# Altium schematic sheet Main.SchDoc
size A3; PageSetup: Record=PageOptions|CenterHorizontal=True|CenterVertical=True|PrintScale=0.73|XCorrection=1.00|YCorrection=1.00|PrintKind=1|BorderSize=5000000|LeftOffset=0|BottomOffset=0|Orientation=2|PaperLength=1000|PaperWidth=1000|Scale=100|PaperSource=7|PrintQuality=-3|MediaType=1|DitherType=10|PrintScaleMode=1|PaperKind=A4|PaperIndex=9
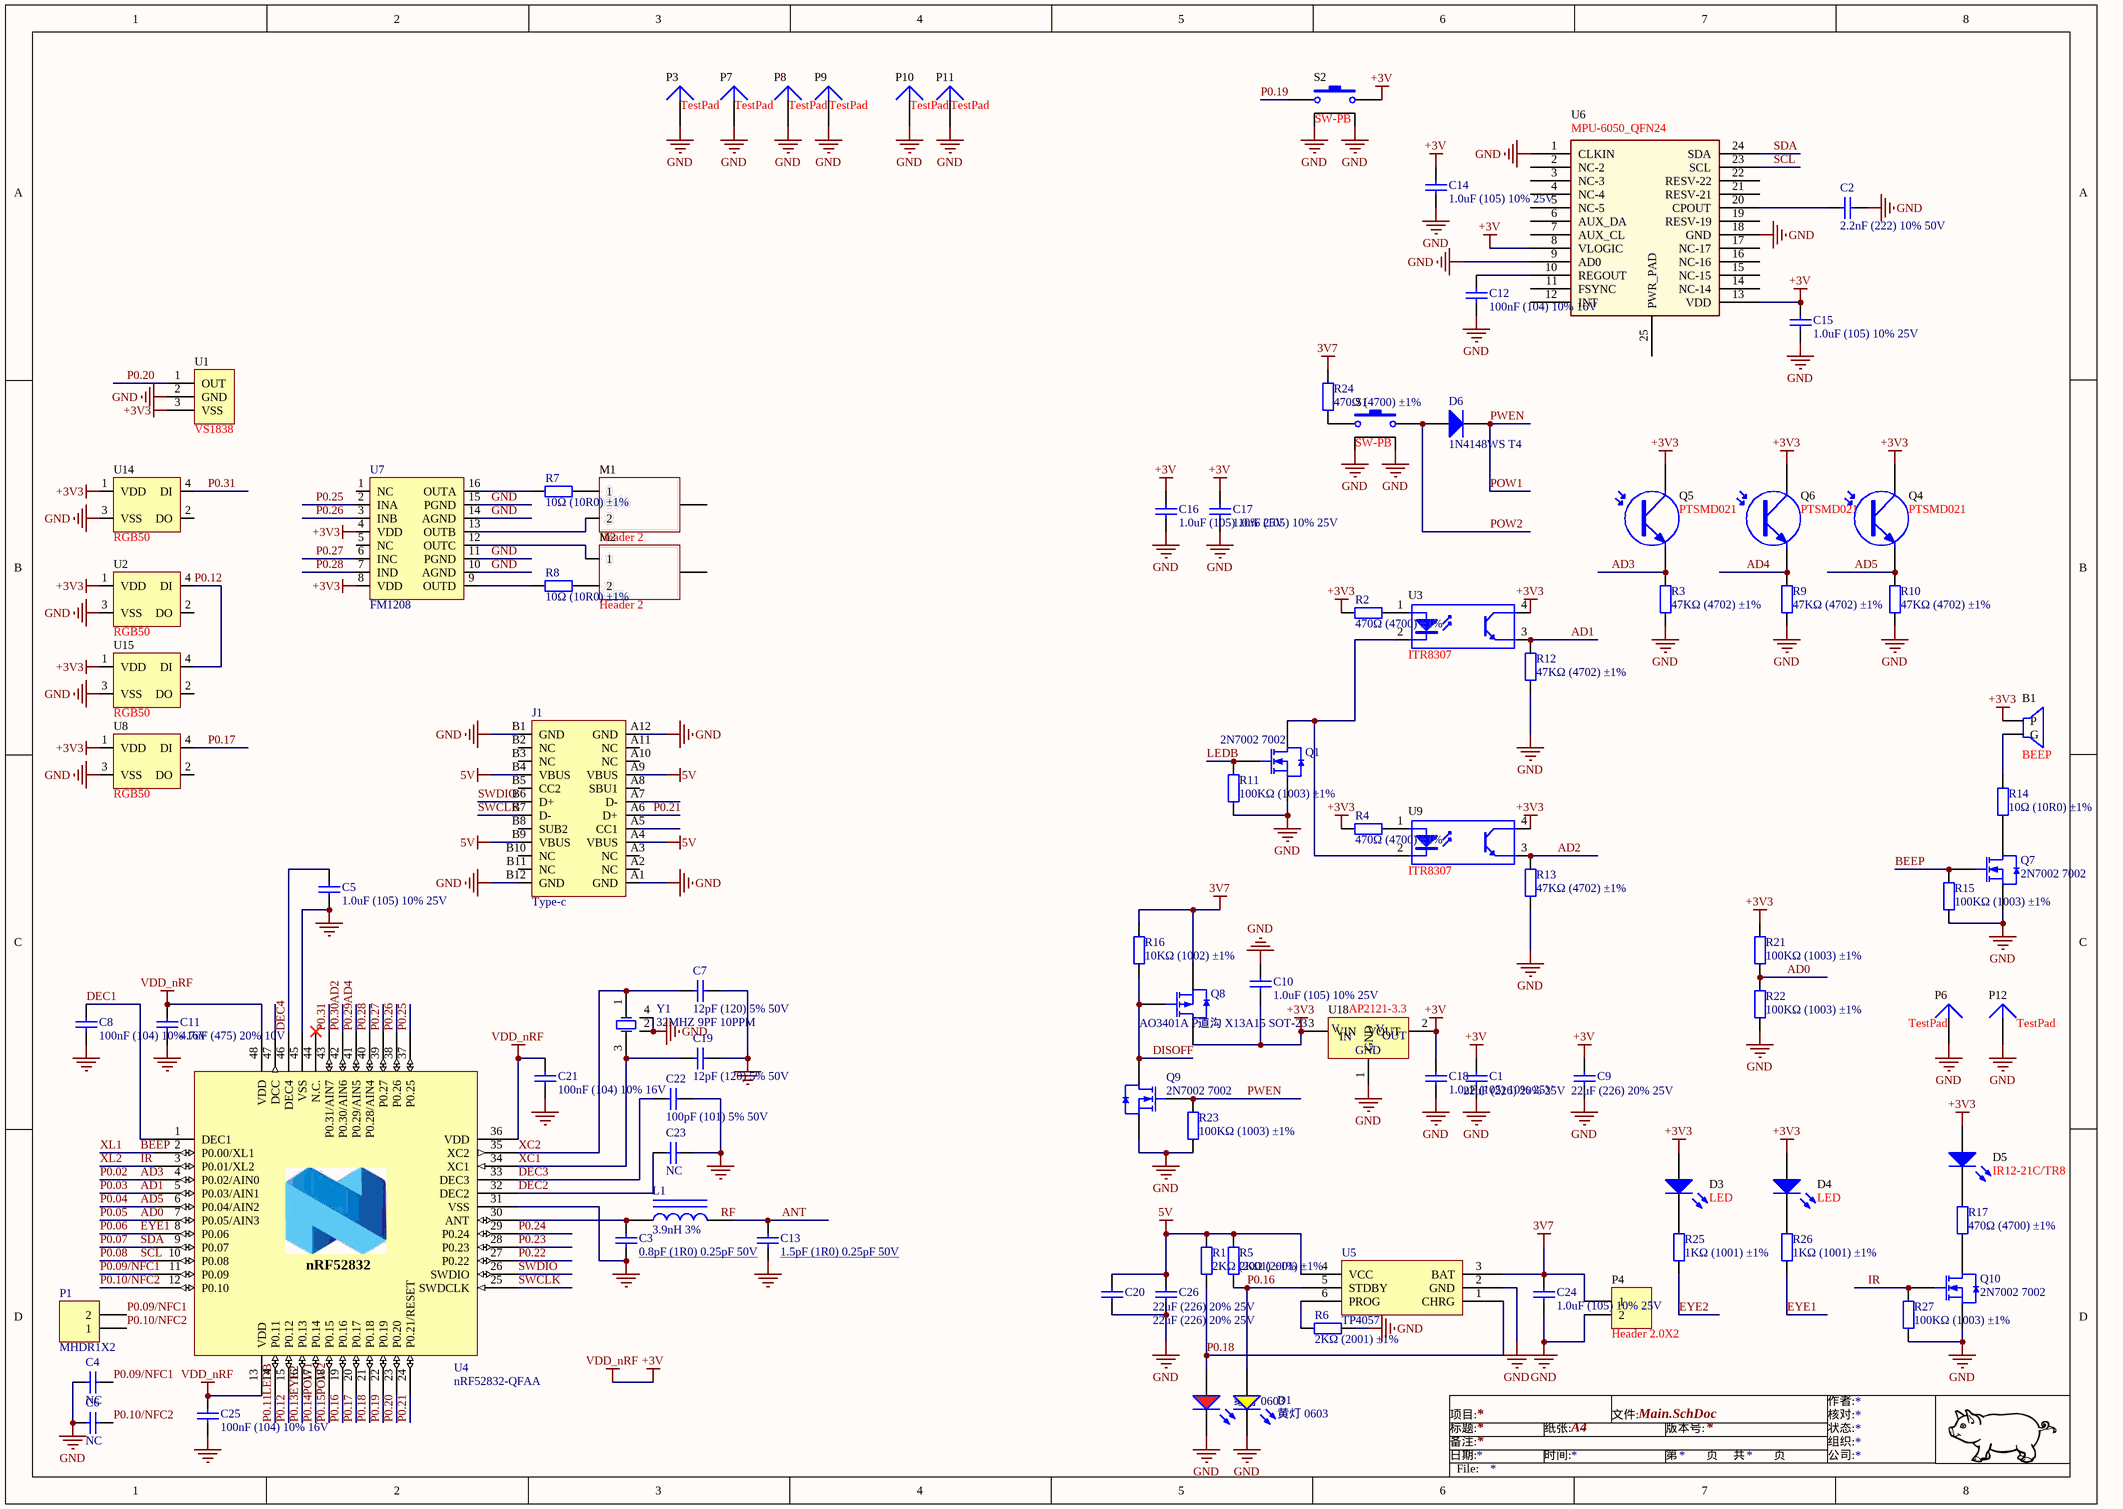
[diagram p0: Main.SchDoc]

## Parts
B1  BEEP  [BEEP]
C1  22uF (226) 20% 25V  [0805_C]
C2  2.2nF (222) 10% 50V  [0402_C]
C3  0.8pF (1R0) 0.25pF 50V  [0402_C]
C4  NC  [0402_C]
C5  1.0uF (105) 10% 25V  [0402_C]
C6  NC  [0402_C]
C7  12pF (120) 5% 50V  [0402_C]
C8  100nF (104) 10% 16V  [0402_C]
C9  22uF (226) 20% 25V  [0805_C]
C10  1.0uF (105) 10% 25V  [0402_C]
C11  4.7uF (475) 20% 10V  [0402_C]
C12  100nF (104) 10% 16V  [0402_C]
C13  1.5pF (1R0) 0.25pF 50V  [0402_C]
C14  1.0uF (105) 10% 25V  [0402_C]
C15  1.0uF (105) 10% 25V  [0402_C]
C16  1.0uF (105) 10% 25V  [0402_C]
C17  1.0uF (105) 10% 25V  [0402_C]
C18  1.0uF (105) 10% 25V  [0402_C]
C19  12pF (120) 5% 50V  [0402_C]
C20  22uF (226) 20% 25V  [0805_C]
C21  100nF (104) 10% 16V  [0402_C]
C22  100pF (101) 5% 50V  [0402_C]
C23  NC  [0402_C]
C24  1.0uF (105) 10% 25V  [0402_C]
C25  100nF (104) 10% 16V  [0402_C]
C26  22uF (226) 20% 25V  [0805_C]
D1  黄灯 0603  [0603_LED_S1]
D2  红灯 0603  [0603_LED_S1]
D3  LED  [0802]
D4  LED  [0802]
D5  IR12-21C/TR8  [1206]
D6  1N4148WS T4  [SOD-323]
J1  Type-c  [Type-c]
L1  3.9nH 3%  [0402_L]
M1  Header 2  [PAD2]
M2  Header 2  [PAD2]
P1  MHDR1X2  [MHDR1X2]
P3  TestPad  [MOTO]
P4  Header 2.0X2  [Head2.0]
P6  TestPad  [PAD]
P7  TestPad  [MOTO]
P8  TestPad  [PAD]
P9  TestPad  [PAD]
P10  TestPad  [PAD]
P11  TestPad  [PAD]
P12  TestPad  [PAD]
Q1  2N7002 7002  [SOT-23]
Q4  PTSMD021  [EYE]
Q5  PTSMD021  [EYE]
Q6  PTSMD021  [EYE]
Q7  2N7002 7002  [SOT-23]
Q8  AO3401A P道沟 X13A15 SOT-23  [SOT-23-3L]
Q9  2N7002 7002  [SOT-23]
Q10  2N7002 7002  [SOT-23]
R1  2KΩ (2001) ±1%  [0402_R]
R2  470Ω (4700) ±1%  [0402_R]
R3  47KΩ (4702) ±1%  [0402_R]
R4  470Ω (4700) ±1%  [0402_R]
R5  2KΩ (2001) ±1%  [0402_R]
R6  2KΩ (2001) ±1%  [0402_R]
R7  10Ω (10R0) ±1%  [0603_R]
R8  10Ω (10R0) ±1%  [0603_R]
R9  47KΩ (4702) ±1%  [0402_R]
R10  47KΩ (4702) ±1%  [0402_R]
R11  100KΩ (1003) ±1%  [0402_R]
R12  47KΩ (4702) ±1%  [0402_R]
R13  47KΩ (4702) ±1%  [0402_R]
R14  10Ω (10R0) ±1%  [0402_R]
R15  100KΩ (1003) ±1%  [0402_R]
R16  10KΩ (1002) ±1%  [0402_R]
R17  470Ω (4700) ±1%  [0402_R]
R21  100KΩ (1003) ±1%  [0402_R]
R22  100KΩ (1003) ±1%  [0402_R]
R23  100KΩ (1003) ±1%  [0402_R]
R24  470Ω (4700) ±1%  [0402_R]
R25  1KΩ (1001) ±1%  [0402_R]
R26  1KΩ (1001) ±1%  [0402_R]
R27  100KΩ (1003) ±1%  [0402_R]
S1  SW-PB  [BUTTON]
S2  SW-PB  [BUTTON]
U1  VS1838  [IR38]
U2  RGB50  [HV-EYE - duplicate]
U3  ITR8307  [ITR8307]
U4  nRF52832-QFAA  [QFN40P600X600X90-48N]
U5  TP4057  [SOT23-6_N]
U6  MPU-6050_QFN24  [qfn24]
U7  FM1208  [SO-16_L]
U8  RGB50  [WS2812]
U9  ITR8307  [ITR8307]
U14  RGB50  [WS2812]
U15  RGB50  [HV-EYE - duplicate]
U18  AP2121-3.3  [SOT-23]
Y1  32MHZ 9PF 10PPM  [SMD-3225_4P]

## Nets
3V7: C24.2 P4.1 Q8.2(S) R16.2 R24.2 U5.3(BAT)
5V: C20.2 C26.2 J1.A4(VBUS) J1.A9(VBUS) J1.B4(VBUS) J1.B9(VBUS) R1.2 R5.2 U5.4(VCC)
+3V: C1.2 C9.2 C11.2 C14.2 C15.2 C16.2 C17.2 C18.2 C21.2 C25.2 S2.1 U4.13(VDD) U4.36(VDD) U4.48(VDD) U6.8(VLOGIC) U6.13(VDD) U18.2(VOUT)  [also labelled VDD_nRF]
+3V3: B1.1(P) C10.1 D3.1(A) D4.1(A) D5.1(A) Q4.1(C) Q5.1(C) Q6.1(C) Q8.3(D) R2.1 R4.1 R21.2 U1.3(VSS) U2.1(VDD) U3.4(C) U7.4(VDD) U7.8(VDD) U8.1(VDD) U9.4(C) U14.1(VDD) U15.1(VDD) U18.3(VIN)
GND: C1.1 C2.2 C3.1 C4.2 C5.1 C6.1 C7.2 C8.1 C9.1 C10.2 C11.1 C12.1 C13.1 C14.1 C15.1 C16.1 C17.1 C18.1 C19.2 C20.1 C21.1 C22.2 C23.2 C24.1 C25.1 C26.1 D1.K D2.K J1.A1(GND) J1.A12(GND) J1.B1(GND) J1.B12(GND) P3.1 P4.2 P6.1 P7.1 P8.1 P9.1 P10.1 P11.1 P12.1 Q1.2(S) Q7.2(S) Q9.2(S) Q10.2(S) R3.1 R6.2 R9.1 R10.1 R11.1 R12.1 R13.1 R15.1 R22.1 R23.1 R27.1 S1.3 S1.4 S2.3 S2.4 U1.2(GND) U2.3(VSS) U4.31(VSS) U4.45(VSS) U4.49(GND) U5.2(GND) U6.1(CLKIN) U6.9(AD0) U6.18(GND) U7.10(AGND) U7.11(PGND) U7.14(AGND) U7.15(PGND) U8.3(VSS) U14.3(VSS) U15.3(VSS) U18.1(GND) Y1.2(GND) Y1.4(GND)
AD0: R21.1 R22.2 U4.7(P0.05/AIN3)  [also labelled P0.05]
AD1: R12.2 U3.3(E) U4.5(P0.03/AIN1)  [also labelled P0.03]
AD2: R13.2 U4.42(P0.30/AIN6) U9.3(E)  [also labelled P0.30]
AD3: Q5.2(E) R3.2 U4.4(P0.02/AIN0)  [also labelled P0.02]
AD4: Q6.2(E) R9.2 U4.41(P0.29/AIN5)  [also labelled P0.29]
AD5: Q4.2(E) R10.2 U4.6(P0.04/AIN2)  [also labelled P0.04]
ANT: C13.2 L1.2
BEEP: Q7.1(G) R15.2 U4.2(P0.00/XL1)  [also labelled XL1]
DEC1: C8.2 U4.1(DEC1)
DEC2: C23.1 U4.32(DEC2)
DEC3: C22.1 U4.33(DEC3)
DEC4: C5.2 U4.46(DEC4)
DISOFF: Q8.1(G) Q9.3(D) R16.1
EYE1: R26.1 U4.8(P0.06)  [also labelled P0.06]
EYE2: R25.1 U4.16(P0.13)  [also labelled P0.13]
IR: Q10.1(G) R27.2 U4.3(P0.01/XL2)  [also labelled XL2]
LEDB: Q1.1(G) R11.2 U4.14(P0.11)  [also labelled P0.11]
P0.07: U4.9(P0.07) U6.24(SDA)  [also labelled SDA]
P0.08: U4.10(P0.08) U6.23(SCL)  [also labelled SCL]
P0.09/NFC1: C4.1 P1.2 U4.11(P0.09)
P0.10/NFC2: C6.2 P1.1 U4.12(P0.10)
P0.12: U2.4(DI) U4.15(P0.12) U15.4(DI)
P0.14: D6.2(K) Q9.1(G) R23.2 U4.17(P0.14)  [also labelled POW1, PWEN]
P0.15: D6.1(A) S1.2 U4.18(P0.15)  [also labelled POW2]
P0.16: D1.A R5.1 U4.19(P0.16) U5.5(STDBY)
P0.17: U4.20(P0.17) U8.4(DI)
P0.18: D2.A R1.1 U4.21(P0.18) U5.1(CHRG)
P0.19: S2.2 U4.22(P0.19)
P0.20: U1.1(OUT) U4.23(P0.20)
P0.21: J1.A6(D+) U4.24(P0.21/RESET)
P0.22: U4.27(P0.22)
P0.23: U4.28(P0.23)
P0.24: U4.29(P0.24)
P0.25: U4.37(P0.25) U7.2(INA)
P0.26: U4.38(P0.26) U7.3(INB)
P0.27: U4.39(P0.27) U7.6(INC)
P0.28: U4.40(P0.28/AIN4) U7.7(IND)
P0.31: U4.43(P0.31/AIN7) U14.4(DI)
SWCLK: J1.B7(D-) U4.25(SWDCLK)
SWDIO: J1.B6(D+) U4.26(SWDIO)
XC1: C19.1 U4.34(XC1) Y1.3(OSC2)
XC2: C7.1 U4.35(XC2) Y1.1(OSC1)
NetB1_2: B1.2(G) R14.2
NetC2_1: C2.1 U6.20(CPOUT)
NetC3_2: C3.2 L1.1 U4.30(ANT)
NetC12_2: C12.2 U6.10(REGOUT)
NetD3_2: D3.2(K) R25.2
NetD4_2: D4.2(K) R26.2
NetD5_2: D5.2(K) R17.2
NetM1_1: M1.1 R7.2
NetM1_2: M1.2 U7.13(OUTB)
NetM2_1: M2.1 U7.12(OUTC)
NetM2_2: M2.2 R8.2
NetQ1_3: Q1.3(D) U3.2(K) U9.2(K)
NetQ7_3: Q7.3(D) R14.1
NetQ10_3: Q10.3(D) R17.1
NetR2_2: R2.2 U3.1(A)
NetR4_2: R4.2 U9.1(A)
NetR6_1: R6.1 U5.6(PROG)
NetR7_1: R7.1 U7.16(OUTA)
NetR8_1: R8.1 U7.9(OUTD)
NetR24_1: R24.1 S1.1

Not connected (* = marked no-connect by the designer): J1 A2(NC) A3(NC) A5(CC1) A7(D-) A8(SBU1) A10(NC) A11(NC) B2(NC) B3(NC) B5(CC2) B8(SUB2) B10(NC) B11(NC); U2 2(DO); U4 44(N.C.)* 47(DCC); U6 2(NC-2) 3(NC-3) 4(NC-4) 5(NC-5) 6(AUX_DA) 7(AUX_CL) 11(FSYNC) 12(INT) 14(NC-14) 15(NC-15) 16(NC-16) 17(NC-17) 19(RESV-19) 21(RESV-21) 22(RESV-22) 25(PWR_PAD); U7 1(NC) 5(NC); U8 2(DO); U14 2(DO); U15 2(DO)

## Notes on the sheet
- Labels drawn without touching a wire or pin: RF
- 项目:
- 标题:
- 日期:
- 备注:
- 时间:
- 纸张:
- A4
- 文件:
- 版本号:
- 第
- 页
- 共
- 作者:
- 核对:
- 状态:
- 组织:
- 公司:
- File:
- (in symbol AP2121-3) V; IN; OUT
- (in symbol nRF52832-QFAA) nRF52832

## Library data of the parts
B1 = BEEP: 最小蜂鸣器6MM 6038 6035电磁式蜂鸣器 6*3.5 6*3.8MM 无源 交流
C1 C9 C20 C26 = 0805 22uF (226) 20% 25V: 贴片电容; ComponentLink1Description: 供应商链接; ComponentLink1URL: http://www.szlcsc.com/product/details_46786.html; Package: 0805; Supplier: LC; SuppliersPartNumber: C45783
C2 = 0402 2.2nF (222) 10% 50V: 贴片电容; ComponentLink1Description: 供应商链接; ComponentLink1URL: http://www.szlcsc.com/product/details_1883.html; Package: 0402; Supplier: LC; SuppliersPartNumber: C1531
C3 C13 = 0402 1pF (1R0) 0.25pF 50V: 贴片电容; ComponentLink1Description: 供应商链接; ComponentLink1URL: http://www.szlcsc.com/product/details_1902.html; Package: 0402; Supplier: LC; SuppliersPartNumber: C1550
C4 C6 = 0402 1nF (102) 10% 50V: 贴片电容; ComponentLink1Description: 供应商链接; ComponentLink1URL: http://www.szlcsc.com/product/details_1875.html; Package: 0402; Supplier: LC; SuppliersPartNumber: C1523
C5 C10 C14-C18 C24 = 0402 1.0uF (105) 10% 25V: 贴片电容; ComponentLink1Description: 供应商链接; ComponentLink1URL: http://www.szlcsc.com/product/details_53938.html; Package: 0402; Supplier: LC; SuppliersPartNumber: C52923
C7 C19 = 0402 12pF (120) 5% 50V: 贴片电容; ComponentLink1Description: 供应商链接; ComponentLink1URL: http://www.szlcsc.com/product/details_1899.html; Package: 0402; Supplier: LC; SuppliersPartNumber: C1547
C8 C12 C21 C25 = 0402 100nF (104) 10% 16V: 贴片电容; ComponentLink1Description: 供应商链接; ComponentLink1URL: http://www.szlcsc.com/product/details_1877.html; Package: 0402; Supplier: LC; SuppliersPartNumber: C1525
C11 = 0402 4.7uF (475) 20% 10V: 贴片电容; ComponentLink1Description: 供应商链接; ComponentLink1URL: http://www.szlcsc.com/product/details_24469.html; Package: 0402; Supplier: LC; SuppliersPartNumber: C23733
C22 C23 = 0402 100pF (101) 5% 50V: 贴片电容; ComponentLink1Description: 供应商链接; ComponentLink1URL: http://www.szlcsc.com/product/details_1898.html; Package: 0402; Supplier: LC; SuppliersPartNumber: C1546
D1 = 0603 黄灯: 发光二极管; ComponentLink1Description: 供应商链接; ComponentLink1URL: http://www.szlcsc.com/product/details_73147.html; Package: 0603; Supplier: LC; SuppliersPartNumber: C72038
D2 = 0603 红灯: 发光二极管; ComponentLink1Description: 供应商链接; ComponentLink1URL: http://www.szlcsc.com/product/details_2659.html; Package: 0603; Supplier: LC; SuppliersPartNumber: C2286
D3 D4 = LED2: Typical RED, GREEN, YELLOW, AMBER GaAs LED; pin to pad: 1>2 2>1; Published: 8-Jun-2000; LatestRevisionDate: 17-Jul-2002; LatestRevisionNote: Re-released for DXP Platform.; PackageVersion: Feb-2002; PackageReference: 3.2X1.6X1.1; Publisher: Altium Limited; PackageDescription: SM LED; 2 Flat Leads
D5 = LED2: 侧贴红外发射管; Published: 8-Jun-2000; LatestRevisionDate: 17-Jul-2002; LatestRevisionNote: Re-released for DXP Platform.; PackageVersion: Feb-2002; PackageReference: 3.2X1.6X1.1; Publisher: Altium Limited; PackageDescription: SM LED; 2 Flat Leads
D6 = SOD-323 1N4148WS T4: 二极管; ComponentLink1Description: 供应商链接; ComponentLink1URL: http://www.szlcsc.com/product/details_2485.html; Package: SOD-323; Supplier: LC; SuppliersPartNumber: C2128
L1 = 0402 3.9nH 3%: 贴片电感; ComponentLink1Description: 供应商链接; ComponentLink1URL: http://www.szlcsc.com/product/details_14690.html; Package: 0402; Supplier: LC; SuppliersPartNumber: C14033
M1 M2 = Header 2: Header, 2-Pin; LatestRevisionDate: 17-Jul-2002; LatestRevisionNote: Re-released for DXP Platform.; Publisher: Altium Limited
P1 = MHDR1X2: Header, 2-Pin; LatestRevisionDate: 17-Jul-2002; LatestRevisionNote: Re-released for DXP Platform.; Publisher: Altium Limited
P3 P6-P12 = Plug: LatestRevisionDate: 17-Jul-2002; LatestRevisionNote: Re-released for DXP Platform.; Publisher: Altium Limited
P4 = Header 2: 2.0dip连接器; LatestRevisionDate: 17-Jul-2002; LatestRevisionNote: Re-released for DXP Platform.; Publisher: Altium Limited
Q1 Q7 Q9 Q10 = 2N7002 7002: MOS(场效应管); ComponentLink1Description: 供应商链接; ComponentLink1URL: http://www.szlcsc.com/product/details_9040.html; Package: SOT-23(SOT-23-3); Supplier: LC; SuppliersPartNumber: C8545
Q4-Q6 = Photo NPN: 光线传感器; Published: 24-Mar-1999; LatestRevisionDate: 17-Jul-2002; LatestRevisionNote: Re-released for DXP Platform.; PackageReference: TO-220_A; Publisher: Altium Limited; Code_JEDEC: TO-220-AC
Q8 = AO3401A P道沟 X13A15 SOT-23: MOS(场效应管); ComponentLink1Description: 供应商链接; ComponentLink1URL: http://www.szlcsc.com/product/details_15801.html; Package: SOT-23; Supplier: LC; SuppliersPartNumber: C15127
R1 R5 R6 = 0402 2KΩ (2001) 1%: 贴片电阻; ComponentLink1Description: 供应商链接; ComponentLink1URL: http://www.szlcsc.com/product/details_4516.html; Package: 0402; Supplier: LC; SuppliersPartNumber: C4109
R2 R4 R17 R24 = 0402 470Ω (4700) 1%: 贴片电阻; ComponentLink1Description: 供应商链接; ComponentLink1URL: http://www.szlcsc.com/product/details_25860.html; Package: 0402; Supplier: LC; SuppliersPartNumber: C25117
R3 R9 R10 R12 R13 = 0402 47KΩ (4702) 1%: 贴片电阻; ComponentLink1Description: 供应商链接; ComponentLink1URL: http://www.szlcsc.com/product/details_26535.html; Package: 0402; Supplier: LC; SuppliersPartNumber: C25792
R7 R8 = 0603 10Ω (10R0) 1%: 贴片电阻; ComponentLink1Description: 供应商链接; ComponentLink1URL: http://www.szlcsc.com/product/details_23586.html; Package: 0603; Supplier: LC; SuppliersPartNumber: C22859
R11 R15 R21-R23 R27 = 0402 100KΩ (1003) 1%: 贴片电阻; ComponentLink1Description: 供应商链接; ComponentLink1URL: http://www.szlcsc.com/product/details_26484.html; Package: 0402; Supplier: LC; SuppliersPartNumber: C25741
R14 = 0402 10Ω (10R0) 1%: 贴片电阻; ComponentLink1Description: 供应商链接; ComponentLink1URL: http://www.szlcsc.com/product/details_25820.html; Package: 0402; Supplier: LC; SuppliersPartNumber: C25077
R16 = 0402 10KΩ (1002) 1%: 贴片电阻; ComponentLink1Description: 供应商链接; ComponentLink1URL: http://www.szlcsc.com/product/details_26487.html; Package: 0402; Supplier: LC; SuppliersPartNumber: C25744
R25 R26 = 0402 1KΩ (1001) 1%: 贴片电阻; ComponentLink1Description: 供应商链接; ComponentLink1URL: http://www.szlcsc.com/product/details_12256.html; Package: 0402; Supplier: LC; SuppliersPartNumber: C11702
S1 S2 = SW-PB: 3x6x3.5H 3*6*3.5贴片 侧位 按钮; Published: 24-Mar-1999; LatestRevisionDate: 17-Jul-2002; LatestRevisionNote: Re-released for DXP Platform.; PackageReference: SPST-2; Publisher: Altium Limited; PackageDescription: Switch; 2 Leads
U1 = RF: 1838 接收头 VS1838 VS1838B
U2 U15 = RGB50: 全彩REG灯珠PCB附件
U3 U9 = Optoisolator1: 反射式光学传感器; pin to pad: 1>2 2>1 3>4 4>3; Published: 24-Mar-1999; LatestRevisionDate: 04-Mar-2005; LatestRevisionNote: Sch pins 3 & 4 Swapped.; DatasheetVersion: Nov-2003; PackageReference: DIP-4; Publisher: Altium Limited
U4 = nRF52832-QFAA: Multi-protocol Bluetooth Low Energy and 2.4GHz proprietary system-on-chip; Manufacturer: Nordic Semiconductor; Artikkelnr Noca: N.A.; Part Number: nRF52832-QFAA; Manufacturer Part Number: nRF52832-QFAA; Datasheet: *; LatestRevisionDate: 2014-11-26; Pin Count: 48; Publisher: Nordic Semiconductor; Published: 2014-11-26; Value: nRF52832-QFAA; Note: *; Supplier: Nordic Semiconductor; Supplier part number: *; 2nd source Supplier: *; 2nd source part number: *; Footprint Doc: QFN-48; Artikkelnr Simpro: N.A.
U5 = TP4057: 电池电源管理; ComponentLink1Description: 供应商链接; ComponentLink1URL: http://www.szlcsc.com/product/details_12599.html; Package: SOT-23-6; Supplier: LC; SuppliersPartNumber: C12044
U6 = MPU06050_QFN24: 三轴陀螺仪加速度
U7 = FM1208S
U8 U14 = RGB50: WS2812全彩RGB灯珠
U18 = AP2121-3: 3V LDO
Y1 = SMD-3225_4P  16MHZ 9PF 10PPM: 贴片晶振; ComponentLink1Description: 供应商链接; ComponentLink1URL: http://www.szlcsc.com/product/details_14393.html; Package: SMD-3225_4P; Supplier: LC; SuppliersPartNumber: C13738